# EAGLE design PulseGen (EAGLE 6.4)
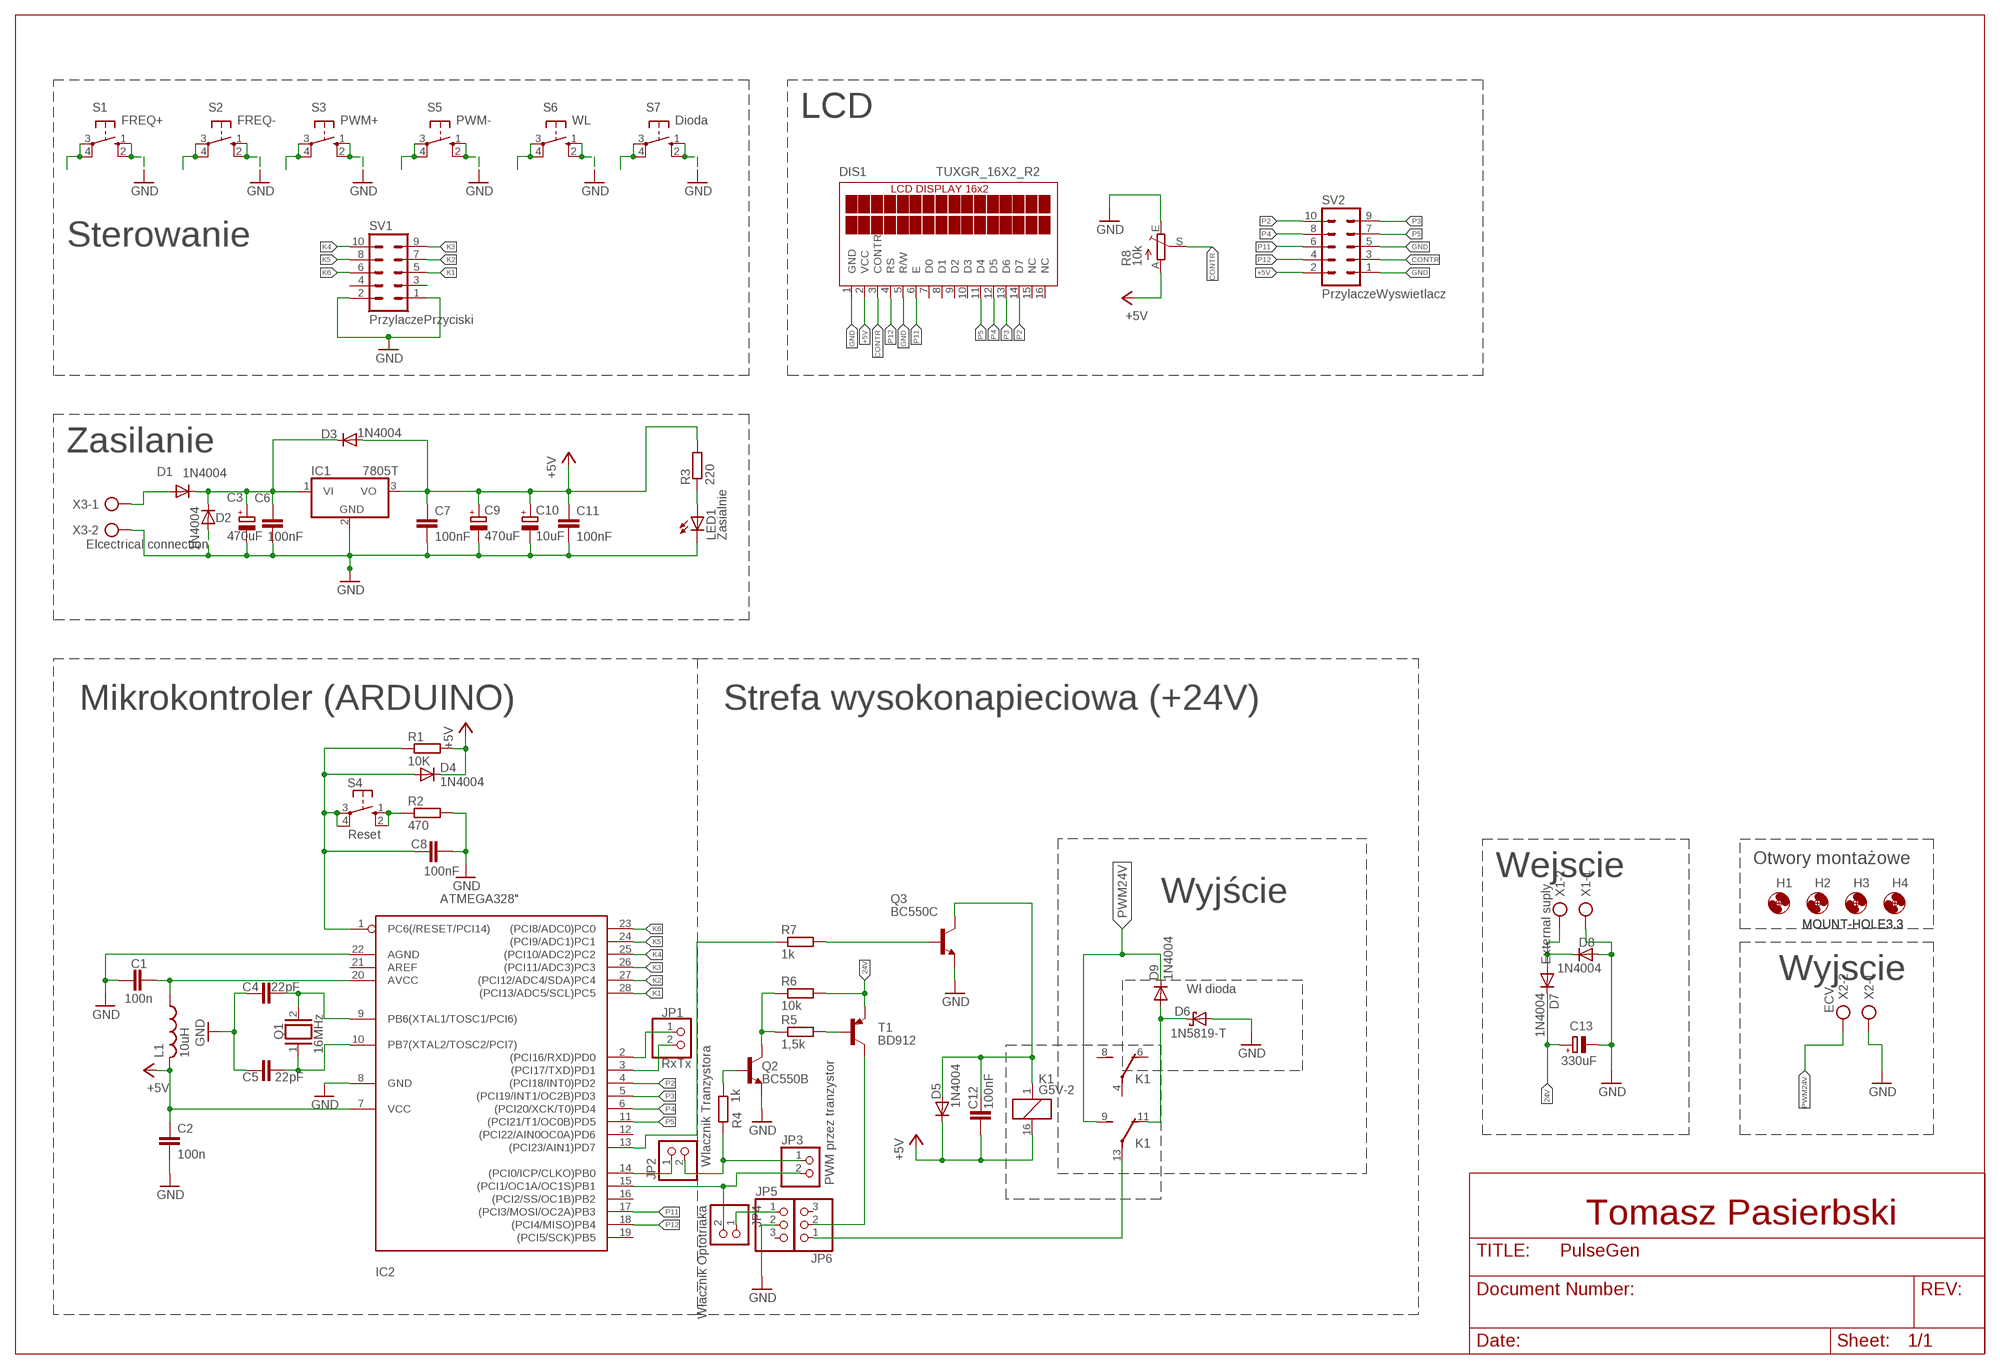
[diagram p0: schematic, sheet 1]

## Parts
C1  100n  C-EU025-030X050  [C025-030X050]
C2  100n  C-EU025-030X050  [C025-030X050]
C3  470uF  CPOL-EUE3.5-8  [E3,5-8]
C4  22pF  C-EU025-024X044  [C025-024X044]
C5  22pF  C-EU025-024X044  [C025-024X044]
C6  100nF  C-EU025-030X050  [C025-030X050]
C7  100nF  C-EU025-030X050  [C025-030X050]
C8  100nF  C-EU025-030X050  [C025-030X050]
C9  470uF  CPOL-EUE3.5-8  [E3,5-8]
C10  10uF  CPOL-EUE5-6  [E5-6]
C11  100nF  C-EU025-030X050  [C025-030X050]
C12  100nF  C-EU025-030X050  [C025-030X050]
C13  330uF  CPOL-EUE7.5-18  [E7,5-18]
D1  1N4004  [DO41-10]
D2  1N4004  [DO41-10]
D3  1N4004  [DO41-10]
D4  1N4004  [DO41-10]
D5  1N4004  [DO41-10]
D6  1N5819-T  [DO41-7.6]
D7  1N4004  [DO41-10]
D8  1N4004  [DO41-10]
D9  1N4004  [DO41-10]
DIS1  TUXGR_16X2_R2  [TUXGR_16X2_R2]
H1  MOUNT-HOLE3.3  [3,3]
H2  MOUNT-HOLE3.3  [3,3]
H3  MOUNT-HOLE3.3  [3,3]
H4  MOUNT-HOLE3.3  [3,3]
IC1  7805T  [TO220H]
IC2  ATMEGA328"  [ATMEGA328]
JP1  RxTx  PINHD-1X2  [1X02]
JP2  Wlacznik Tranzystora  PINHD-1X2  [1X02]
JP3  PWM przez tranzystor  PINHD-1X2  [1X02]
JP4  Włacznik Optotriaka  PINHD-1X2  [1X02]
JP5  PINHD-1X3  [1X03]
JP6  PINHD-1X3  [1X03]
K1  G5V-2  [G5V-2]
L1  10uH  L-US0204/7  [0204/7]
LED1  Zasialnie  LED5MM  [LED5MM]
Q1  16MHz  XTAL/S  [QS]
Q2  BC550B  [TO92-EBC]
Q3  BC550C  [TO92-EBC]
R1  10K  R-EU_0207/2V  [0207/2V]
R2  470  R-EU_0207/2V  [0207/2V]
R3  220  R-EU_0204/7  [0204/7]
R4  1k  R-EU_0204/7  [0204/7]
R5  1,5k  R-EU_0207/12  [0207/12]
R6  10k  R-EU_0204/7  [0204/7]
R7  1k  R-EU_0204/7  [0204/7]
R8  10k  TRIM_EU-CA6V  [CA6V]
S1  FREQ+  10-XX  [B3F-10XX]
S2  FREQ-  10-XX  [B3F-10XX]
S3  PWM+  10-XX  [B3F-10XX]
S4  Reset  10-XX  [B3F-10XX]
S5  PWM-  10-XX  [B3F-10XX]
S6  WL  10-XX  [B3F-10XX]
S7  Dioda  10-XX  [B3F-10XX]
SV1  PrzylaczePrzyciski  ML10  [ML10]
SV2  PrzylaczeWyswietlacz  ML10  [ML10]
T1  BD912  TIP32  [TO220]
X1  External suply  AK300/2  [AK300/2]
X2  ECV  AK300/2  [AK300/2]
X3  Elcectrical connection  AK300/2  [AK300/2]

## Nets
24V: C13.+ D7.C R6.2 T1.3(E)
+5V: C2.1 C7.1 C9.+ C10.+ C11.1 C12.2 D3.A D4.C D5.C DIS1.2(VCC) IC1.3(VO) IC2.7(VCC) K1.16 L1.2 R1.2 R3.2 R8.A SV2.2
+24V: D7.A D8.C X1.2
CONTR: DIS1.3(CONTR) R8.S SV2.3
GND: C1.2 C2.2 C3.- C4.1 C5.1 C6.2 C7.2 C8.2 C9.- C10.- C11.2 C13.- D2.A D6.A D8.A DIS1.1(GND) DIS1.5(R/W) IC1.2(GND) IC2.8(GND) IC2.22(AGND) JP5.2 LED1.K(C) Q2.E Q3.E R2.2 R8.E S1.1(S) S1.2(S1) S2.1(S) S2.2(S1) S3.1(S) S3.2(S1) S5.1(S) S5.2(S1) S6.1(S) S6.2(S1) S7.1(S) S7.2(S1) SV1.1 SV1.2 SV2.1 SV2.5 X1.1 X2.1 X3.2
K1: IC2.28((PCI13/ADC5/SCL)PC5) SV1.5
K2: IC2.27((PCI12/ADC4/SDA)PC4) SV1.7
K3: IC2.26((PCI11/ADC3)PC3) SV1.9
K4: IC2.25((PCI10/ADC2)PC2) SV1.10
K5: IC2.24((PCI9/ADC1)PC1) SV1.8
K6: IC2.23((PCI8/ADC0)PC0) SV1.6
N$1: C5.2 IC2.10(PB7(XTAL2/TOSC2/PCI7)) Q1.1
N$2: C3.+ C6.1 D1.C D2.C D3.C IC1.1(VI)
N$3: C4.2 IC2.9(PB6(XTAL1/TOSC1/PCI6)) Q1.2
N$4: D1.A X3.1
N$6: C12.1 D5.A K1.1 Q3.C
N$7: C1.1 IC2.20(AVCC) L1.1
N$8: Q3.B R7.2
N$9: JP2.2 JP3.1 R4.1
N$10: Q2.C R5.1 R6.1
N$11: R2.1 S4.1(S) S4.2(S1)
N$12: C8.1 D4.A IC2.1(PC6(/RESET/PCI14)) R1.1 S4.3(P) S4.4(P1)
N$13: JP6.1 K1.13(2:P)
N$14: IC2.13((PCI23/AIN1)PD7) R7.1
N$15: Q2.B R4.2
N$16: R5.2 T1.1(B)
N$17: JP6.2 T1.2(C)
N$18: IC2.14((PCI0/ICP/CLKO)PB0) JP2.1
N$19: LED1.A R3.1
N$20: IC2.15((PCI1/OC1A/OC1S)PB1) JP3.2 JP4.2
N$21: S1.3(P) S1.4(P1)
N$22: S2.3(P) S2.4(P1)
N$23: S3.3(P) S3.4(P1)
N$24: S5.3(P) S5.4(P1)
N$25: S6.3(P) S6.4(P1)
N$26: S7.3(P) S7.4(P1)
N$27: IC2.3((PCI17/TXD)PD1) JP1.2
N$28: IC2.2((PCI16/RXD)PD0) JP1.1
N$29: JP4.1 JP5.1
N$30: D6.C D9.A K1.11(2:O)
P2: DIS1.14(D7) IC2.4((PCI18/INT0)PD2) SV2.10
P3: DIS1.13(D6) IC2.5((PCI19/INT1/OC2B)PD3) SV2.9
P4: DIS1.12(D5) IC2.6((PCI20/XCK/T0)PD4) SV2.8
P5: DIS1.11(D4) IC2.11((PCI21/T1/OC0B)PD5) SV2.7
P11: DIS1.6(E) IC2.17((PCI3/MOSI/OC2A)PB3) SV2.6
P12: DIS1.4(RS) IC2.18((PCI4/MISO)PB4) SV2.4
PWM24V: D9.C K1.9(2:S) X2.2
Unconnected: DIS1.7(D0) DIS1.8(D1) DIS1.9(D2) DIS1.10(D3) DIS1.15(NC) DIS1.16(NC) IC2.12((PCI22/AIN0OC0A)PD6) IC2.16((PCI2/SS/OC1B)PB2) IC2.19((PCI5/SCK)PB5) IC2.21(AREF) JP5.3 JP6.3 K1.4(1:P) K1.6(1:O) K1.8(1:S) SV1.3 SV1.4

## Notes on the sheet
- LCD
- Sterowanie
- Zasilanie
- Mikrokontroler (ARDUINO) | Strefa wysokonapieciowa (+24V)
- Otwory montażowe
- Wejscie
- Wyjście
- Wyjscie
- Wł dioda
- Tomasz Pasierbski

## Library data of the parts
C1 C2 C4-C8 C11 C12 = rcl:C-EU: CAPACITOR, European symbol
C3 C9 C10 C13 = rcl:CPOL-EU: POLARIZED CAPACITOR, European symbol
D1-D5 D7-D9 = diode:1N4004: DIODE general purpose rectifier, 1 A
D6 = diode:1N581*: 1.0A SCHOTTKY BARRIER RECTIFIER Source: http://www.diodes.com/datasheets/ds23001.pdf
DIS1 = display-lcd:TUXGR_16X2_R2: Tuxgraphics LCD display 16x2 characters reflective, without background light Source: tuxgr_12x2_r2.pdf; OC_FARNELL: unknown; OC_NEWARK: unknown
H1-H4 = holes:MOUNT-HOLE: MOUNTING HOLE with drill center marker
IC1 = linear:78*: Positive VOLTAGE REGULATOR Source: http://cache.national.com/ds/LM/LM78L05.pdf http://www.fairchildsemi.com/ds/LM/LM7805.pdf
IC2 = RBBB:ATMEGA328: MICROCONTROLLER 16 kBytes FLASH 1 kBytes SRAM 512 Bytes EEPROM USART 8-channel 10 bit ADC
JP1-JP4 = pinhead:PINHD-1X2: PIN HEADER
JP5 JP6 = pinhead:PINHD-1X3: PIN HEADER
K1 = relay:G5V-2: OMRON PCB Relay Source: http://www.omron.com/ecb/products/pdf/en-g5v2.pdf; MPN: G5V-2 5DC; OC_FARNELL: 9949488; OC_NEWARK: 78K5703
L1 = rcl:L-US: INDUCTOR, American symbol
LED1 = adafruit:LED: LED OSRAM: - CHIPLED LG R971, LG N971, LY N971, LG Q971, LY Q971, LO R971, LY R971 LH N974, LH R974 LS Q976, LO Q976, LY Q976 LO Q996 - Hyper CHIPLED LW Q18S LB Q993, LB Q99A, LB R99A - SideLED LS A670, LO A670, LY A670, LG A670, LP A670 LB A673, LV A673, LT A673, LW A673 LH A674 LY A675 LS A676, LA A676, LO A676, LY A676, LW A676 LS A679, LY A679, LG A679 - Hyper Micro SIDELED® LS Y876, LA Y876, LO Y876, LY Y876 LT Y87S - SmartLED LW L88C, LW L88S LB L89C, LB L89S, LG L890 LS L89K, LO L89K, LY L89K LS L896, LA L896, LO L896, LY L896 - TOPLED LS T670, LO T670, LY T670, LG T670, LP T670 LSG T670, LSP T670, LSY T670, LOP T670, LYG T670 LG T671, LOG T671, LSG T671 LB T673, LV T673, LT T673, LW T673 LH T674 LS T676, LA T676, LO T676, LY T676, LB T676, LH T676, LSB T676, LW T676 LB T67C, LV T67C, LT T67C, LS T67K, LO T67K, LY T67K, LW E67C LS E67B, LA E67B, LO E67B, LY E67B, LB E67C, LV E67C, LT E67C LW T67C LS T679, LY T679, LG T679 LS T770, LO T770, LY T770, LG T770, LP T770 LB T773, LV T773, LT T773, LW T773 LH T774 LS E675, LA E675, LY E675, LS T675 LS T776, LA T776, LO T776, LY T776, LB T776 LHGB T686 LT T68C, LB T68C - Hyper Mini TOPLED® LB M676 - Mini TOPLED Santana® LG M470 LS M47K, LO M47K, LY M47K Source: http://www.osram.convergy.de/
Q1 = special:XTAL/S: CRYSTAL
Q2 Q3 = transistor-npn:BC550*: NPN Transistor
R1-R7 = rcl:R-EU_: RESISTOR, European symbol
R8 = pot:TRIM_EU-: POTENTIOMETER
S1-S7 = switch-omron:10-XX: OMRON SWITCH; MPN: B3F-1000; OC_FARNELL: 176432; OC_NEWARK: 36M3542
SV1 SV2 = con-harting-ml:ML10: HARTING; OC_FARNELL: unknown; OC_NEWARK: unknown
T1 = transistor:TIP32: PNP Transistor Medium Power Linear Switching Applications Source: http://onsemi.com
X1-X3 = con-ptr500:AK300/2: CONNECTOR; OC_FARNELL: unknown; OC_NEWARK: unknown

## Board
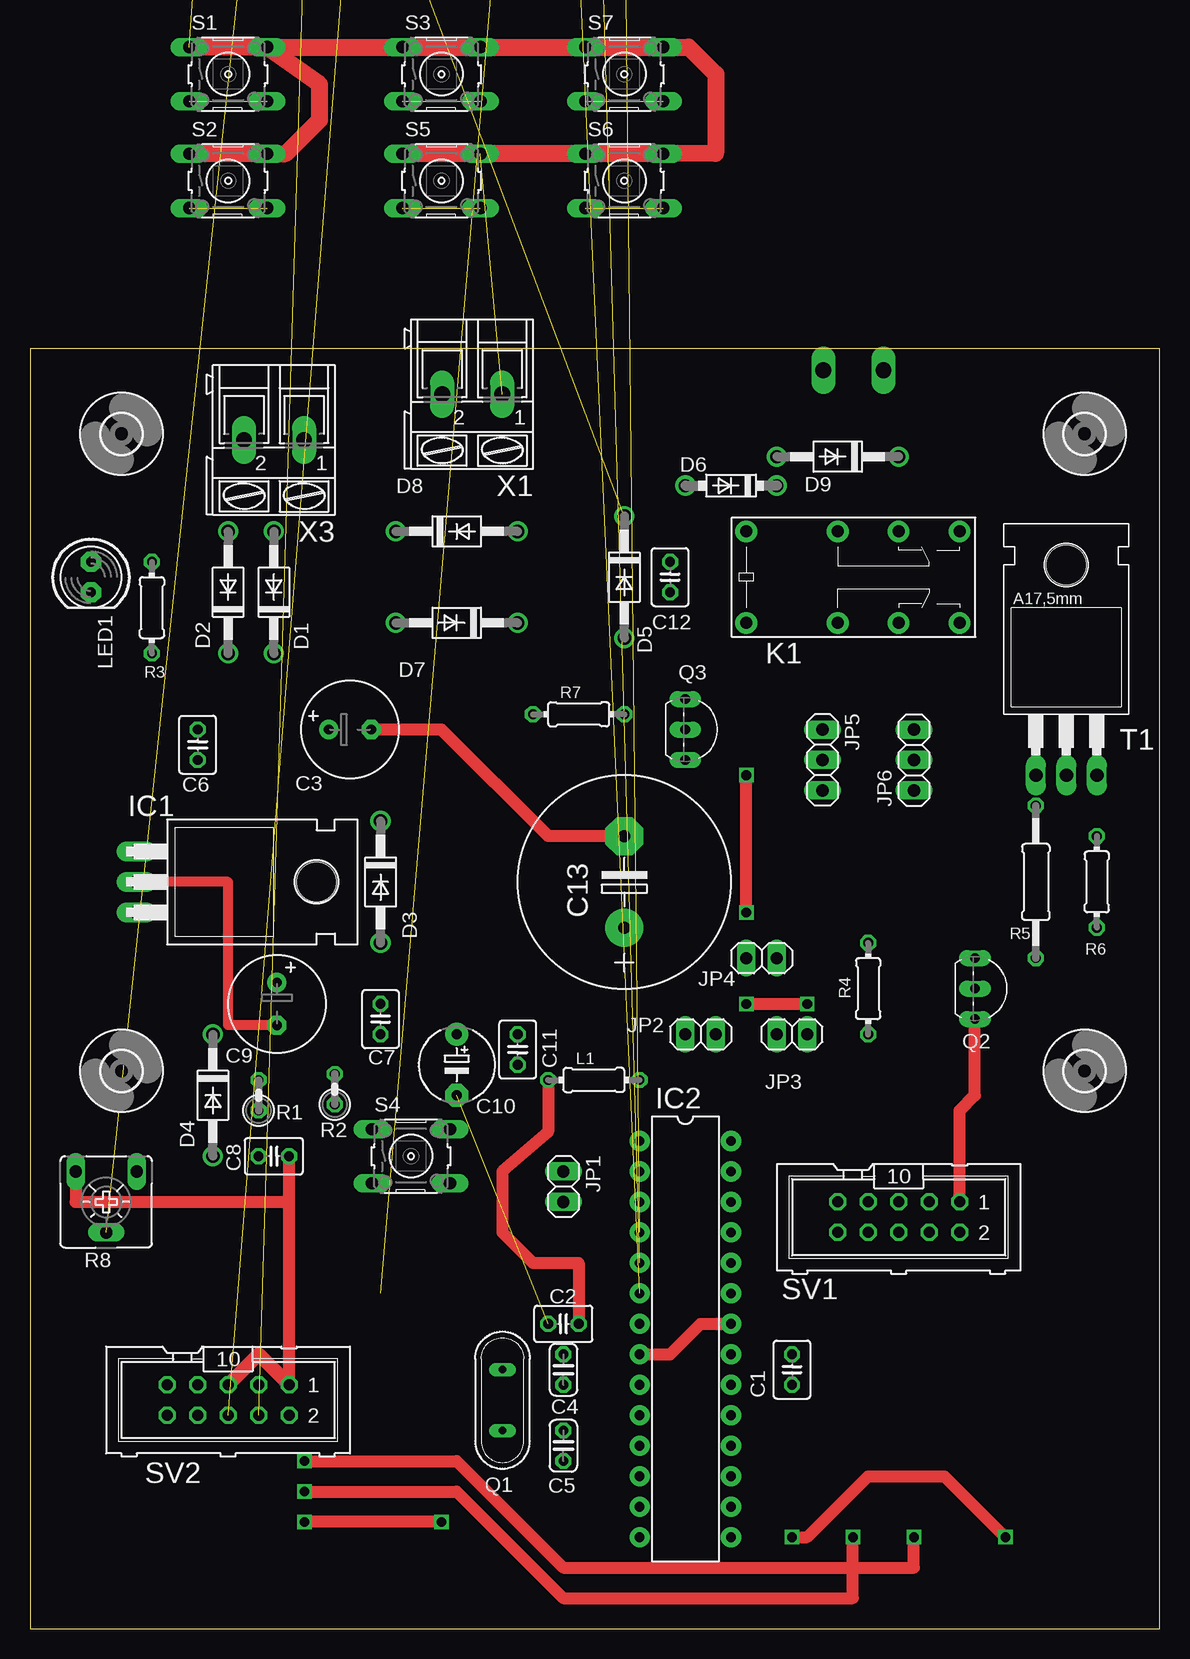
[diagram p1: board, top side]
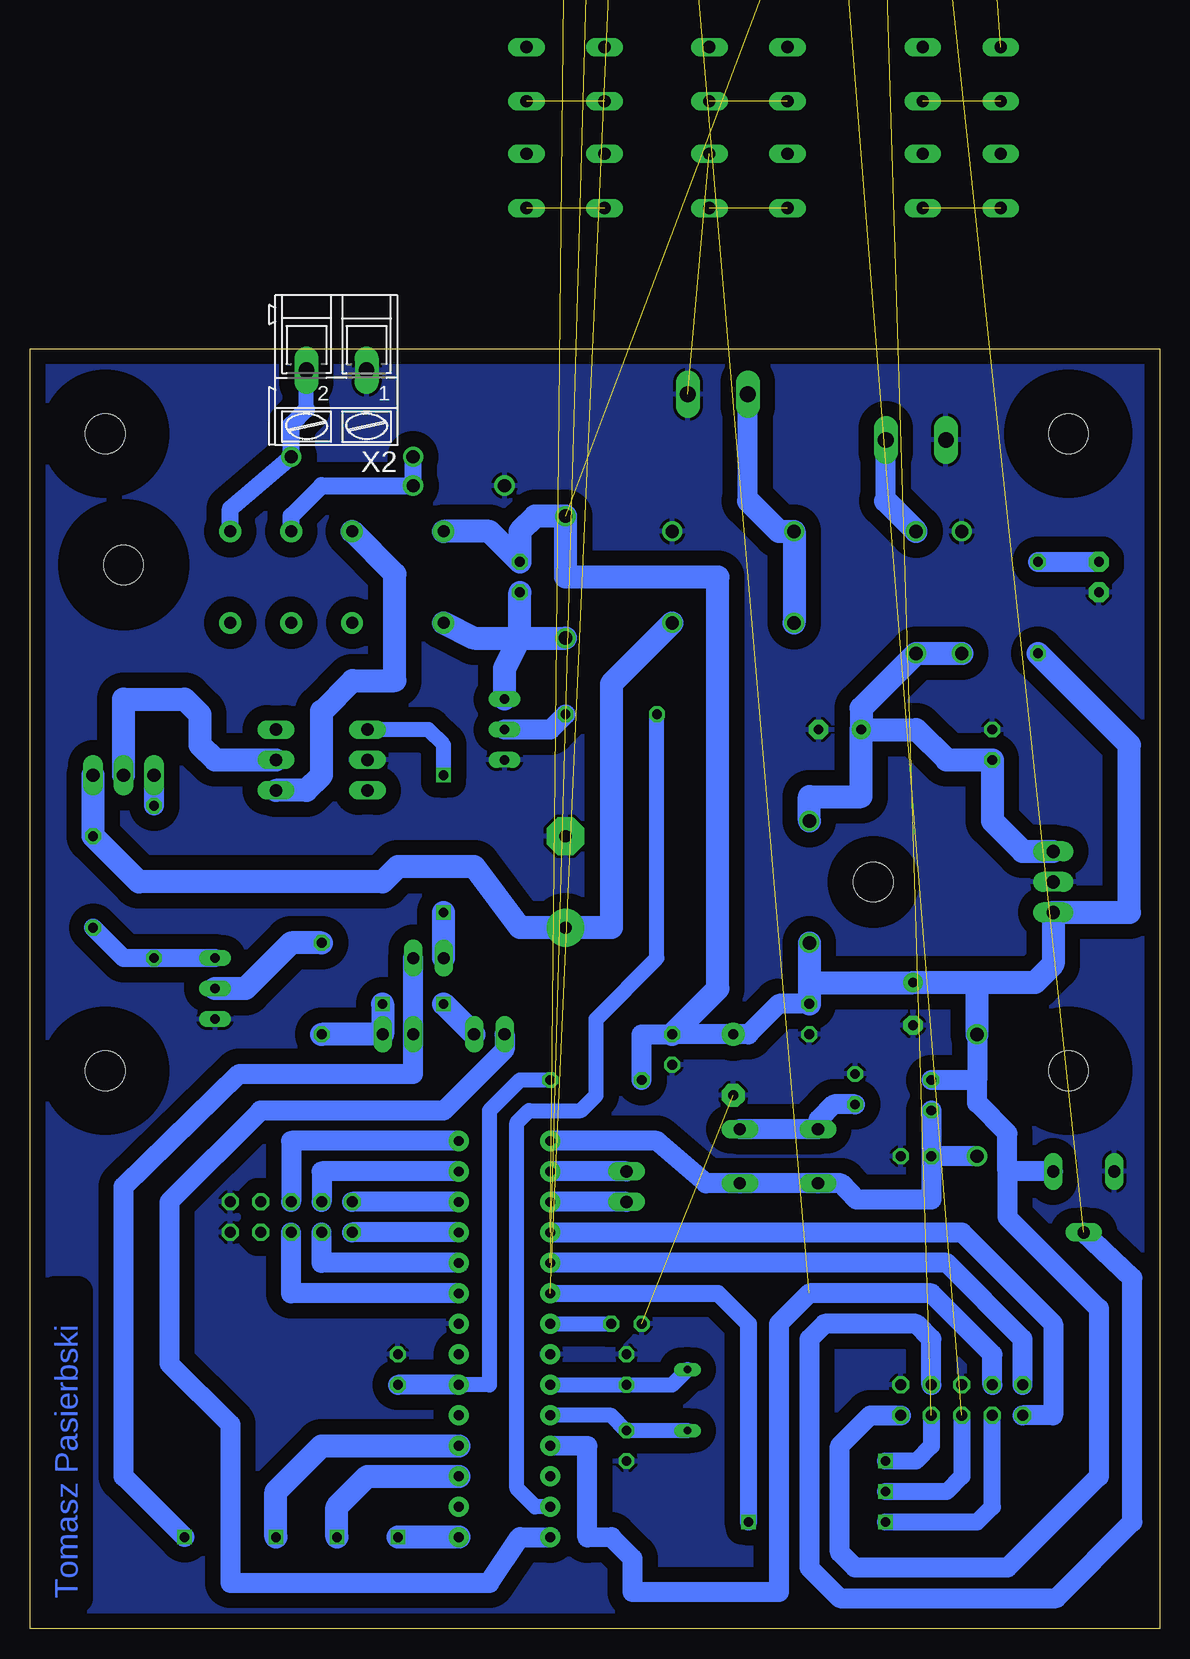
[diagram p2: board, bottom side, seen from below]

Size 94.16 x 106.67 mm. Coordinates in mm from the lower left corner, seen from the top.
Outline: 0,0 94.16,0 94.16,106.67 0,106.67 0,0
Copper layers (1*16): Top 0.035mm / dielectric 1.5mm / Bottom 0.035mm
Design rules "default": minimum track width 10mil, minimum drill 24mil, track to track 8mil, track to pad 8mil, pad to pad 8mil, via to via 8mil, smd to smd 8mil, copper to edge 40mil, drill to drill 8mil, minimum pad ring 10mil, minimum via ring 8mil, stop-mask expansion 4mil, vias tented up to drill 0mil, thermal gap 10mil

### Footprints (pad centres in the part's own frame; a part is rotated, then mirrored left to right if it is on the bottom)
C025-030X050 = drill 0.813 octagon: 1 -1.27,0; 2 1.27,0
E3,5-8 = drill 0.813 pad 1.6: + -1.778,0 | drill 0.813 pad 1.6 octagon: - 1.778,0
C025-024X044 = drill 0.813 octagon: 1 -1.27,0; 2 1.27,0
E5-6 = drill 0.813 pad 1.905: + -2.54,0 | drill 0.813 pad 1.905 octagon: - 2.54,0
E7,5-18 = drill 1.016 pad 3.15: + -3.81,0 | drill 1.016 pad 3.15 octagon: - 3.81,0
DO41-10 = drill 1.118: A 5.08,0; C -5.08,0
DO41-7.6 = drill 1.1 pad 1.7: A 3.81,0; C -3.81,0
TUXGR_16X2_R2 = drill 1 pad 1.676: 1 -32,15.5; 2 -29.46,15.5; 3 -26.92,15.5; 4 -24.38,15.5; 5 -21.84,15.5; 6 -19.3,15.5; 7 -16.76,15.5; 8 -14.22,15.5; 9 -11.68,15.5; 10 -9.14,15.5; 11 -6.6,15.5; 12 -4.06,15.5; 13 -1.52,15.5; 14 1.02,15.5; 15 3.56,15.5; 16 6.1,15.5 | hole 2.5: -37.5,-15.5; 37.5,-15.5; -37.5,15.5; 37.5,15.5
3,3 = hole 3.3: 0,0
TO220H = drill 1.118 long: 1 -2.54,-10.16; 2 0,-10.16; 3 2.54,-10.16 | hole 3.302: 0,4.826
ATMEGA328 = drill 0.813 pad 1.676: 1 -16.51,-3.81; 2 -13.97,-3.81; 3 -11.43,-3.81; 4 -8.89,-3.81; 5 -6.35,-3.81; 6 -3.81,-3.81; 7 -1.27,-3.81; 8 1.27,-3.81; 9 3.81,-3.81; 10 6.35,-3.81; 11 8.89,-3.81; 12 11.43,-3.81; 13 13.97,-3.81; 14 16.51,-3.81; 15 16.51,3.81; 16 13.97,3.81; 17 11.43,3.81; 18 8.89,3.81; 19 6.35,3.81; 20 3.81,3.81; 21 1.27,3.81; 22 -1.27,3.81; 23 -3.81,3.81; 24 -6.35,3.81; 25 -8.89,3.81; 26 -11.43,3.81; 27 -13.97,3.81; 28 -16.51,3.81
1X02 = drill 1.016 long: 1 -1.27,0; 2 1.27,0
1X03 = drill 1.016 long: 1 -2.54,0; 2 0,0; 3 2.54,0
G5V-2 = drill 1 pad 1.8: 1 -8.89,-3.81; 4 -1.27,-3.81; 6 3.81,-3.81; 8 8.89,-3.81; 9 8.89,3.81; 11 3.81,3.81; 13 -1.27,3.81; 16 -8.89,3.81
0204/7 = drill 0.813 octagon: 1 -3.81,0; 2 3.81,0
LED5MM = drill 0.813 pad 1.676 octagon: A -1.27,0; K 1.27,0
QS = drill 0.61 long: 1 -2.54,0; 2 2.54,0
TO92-EBC = drill 0.813 long: B 0,-1.27; C -2.54,-1.27; E 2.54,-1.27
0207/2V = drill 0.813 octagon: 1 -1.27,0; 2 1.27,0
0207/12 = drill 0.813 octagon: 1 -6.35,0; 2 6.35,0
CA6V = drill 1.016 long: A -2.54,-2.54; E 2.54,-2.54; S 0,2.54
B3F-10XX = drill 1.016 long: 1 -3.251,2.261; 2 3.251,2.261; 3 -3.251,-2.261; 4 3.251,-2.261
ML10 = drill 0.914 octagon: 1 -5.08,-1.27; 2 -5.08,1.27; 3 -2.54,-1.27; 4 -2.54,1.27; 5 0,-1.27; 6 0,1.27; 7 2.54,-1.27; 8 2.54,1.27; 9 5.08,-1.27; 10 5.08,1.27
TO220 = drill 1.118 long: 1 -2.54,-6.35; 2 0,-6.35; 3 2.54,-6.35 | hole 3.302: 0,11.176
AK300/2 = drill 1.321 long: 1 -2.515,0; 2 2.489,0

### Placement (x,y rotation side)
C1  63.5,21.59 90 top
C2  44.45,25.4 180 top
C3  26.67,74.93 0 top
C4  44.45,21.59 270 top
C5  44.45,15.24 90 top
C6  13.97,73.66 90 top
C7  29.21,50.8 270 top
C8  20.32,39.37 0 top
C9  20.57,52.07 270 top
C10  35.56,46.99 270 top
C11  40.64,48.26 270 top
C12  53.34,87.63 90 top
C13  49.53,62.23 90 top
D1  20.32,86.36 90 top
D2  16.51,86.36 90 top
D3  29.21,62.23 270 top
D4  15.24,44.45 270 top
D5  49.53,87.63 270 top
D6  58.42,95.25 180 top
D7  35.56,83.82 180 top
D8  35.56,91.44 0 top
D9  67.31,97.66 180 top
DIS1  48.26,158.75 0 top  (outside the outline)
DRILEGEND  [DRILEGEND]  132.33,117.09 0 top  (outside the outline)
H1  87.88,46.48 0 top
H2  7.62,46.48 0 top
H3  87.88,99.57 0 top
H4  7.62,99.57 0 top
IC1  19.05,62.23 270 top
IC2  54.61,24.13 270 top
JP1  44.45,36.83 270 top
JP2  55.88,49.53 0 top
JP3  63.5,49.53 180 top
JP4  60.96,55.88 0 top
JP5  66.04,72.39 270 top
JP6  73.66,72.39 90 top
K1  68.58,87.63 0 top
L1  46.99,45.72 180 top
LED1  5.08,87.63 270 top
Q1  39.37,19.05 90 top
Q2  80.01,53.34 270 top
Q3  55.88,74.93 270 top
R1  19.05,44.45 90 top
R2  25.4,44.96 90 top
R3  10.16,85.09 270 top
R4  69.85,53.34 90 top
R5  83.82,62.23 90 top
R6  88.9,62.23 90 top
R7  45.72,76.2 0 top
R8  6.35,35.56 180 top
S1  16.51,129.54 0 top  (outside the outline)
S2  16.51,120.65 0 top  (outside the outline)
S3  34.29,129.54 0 top  (outside the outline)
S4  31.75,39.37 0 top
S5  34.29,120.65 0 top  (outside the outline)
S6  49.53,120.65 0 top  (outside the outline)
S7  49.53,129.54 0 top  (outside the outline)
SV1  72.39,34.29 180 top
SV2  16.51,19.05 180 top
T1  86.36,77.47 0 top
U$1  [A4P-LOC]  -13.97,-71.12 0 top  (outside the outline)
X1  36.83,102.87 180 top
X2  68.63,104.88 180 bottom
X3  20.32,99.06 180 top

### Tracks (layer width: path | path; a pad name or v marks a point on that pad's centre or on a via)
24V
  Bottom 1.93: T1.3 R6.2 85.09,62.23 64.77,62.23 63.5,63.5 57.15,63.5 53.34,58.42 C13.+ 45.72,58.42 45.72,78.74 43.18,81.28 D7.C
+5V  (1 unrouted)
  Top 1.016: L1.2 43.18,41.4 39.37,38.1 39.37,33.02 41.91,30.48 45.72,30.48 C2.1
  Bottom 1.27: IC2.7 C2.1
  Bottom 1.676: C7.1 31.75,52.07 34.29,49.53 C10.+ C11.1 43.18,49.53 L1.2 | D4.C 15.24,45.72 | 15.24,45.72 R1.2 | 12.7,38.1 12.7,41.27 15.24,43.81 15.24,45.72 | R8.A 12.7,38.1 | 12.7,38.1 12.7,34.29 5.08,26.67 5.08,12.7 12.7,5.08 25.4,5.08 26.67,6.35 26.67,15.24 24.13,17.78 SV2.2
  Bottom 1.93: R3.2 2.54,73.66 2.54,59.69 IC1.3 8.89,55.37 10.41,53.85 15.24,53.85 | D3.A 29.21,53.85 | 29.21,53.85 C9.+ 15.24,53.85 | K1.16 55.88,91.44 C12.2 53.34,91.44 52.07,92.71 D5.C 49.53,87.63 36.83,87.63 36.83,53.34 C11.1 | 29.21,53.85 C7.1 | D4.C 15.24,53.85
+24V
  Bottom 1.676: 34.29,93.98 34.34,93.98 X1.2
  Bottom 1.93: 34.29,93.98 31.75,91.44 D8.C D7.A
CONTR  (1 unrouted)
  Bottom 1.676: SV2.3 19.05,24.13 20.32,25.4 27.94,25.4 29.21,24.13 29.21,5.08 26.67,2.54 8.64,2.54 2.29,8.89 2.29,29.21 R8.S
GND  (4 unrouted)
  Top 0.813: C9.- 16.51,50.29 16.51,62.23 IC1.2
  Top 1.016: SV1.1 77.47,43.18 78.74,44.45 Q2.E | R8.E 3.81,35.56 21.59,35.56 | SV2.1 21.59,35.56 | 21.59,35.56 C8.2 | IC2.8 53.34,22.86 55.88,25.4 IC2.22 | C13.- 43.18,66.04 34.29,74.93 C3.-
  Top 1.15: SV2.5 19.05,22.86 SV2.1
  Top 1.422: S1.2 24.13,128.7 24.13,125.73 21.31,122.91 S2.2 S2.1 | S1.2 S1.1 | S1.2 S3.1 S3.2 S7.1 S7.2 54.89,131.8 57.15,129.54 57.15,123.19 57.12,122.94 S6.2 S6.1 S5.2 S5.1
  pour Bottom (isolate 1.27): -5.08,111.76 101.6,111.76 101.6,-7.62 -5.08,-7.62
K1
  Bottom 1.676: IC2.28 72.39,40.64 SV1.5
K2
  Bottom 1.676: IC2.27 69.85,38.1 SV1.7
K3
  Bottom 1.676: IC2.26 SV1.9
K4
  Bottom 1.676: IC2.25 SV1.10
K5
  Bottom 1.676: IC2.24 69.85,30.48 SV1.8
K6
  Bottom 1.676: IC2.23 72.39,27.94 SV1.6
N$1
  Bottom 1.27: Q1.1 C5.2 45.72,17.78 IC2.10
N$2
  Bottom 1.93: D2.C D1.C 24.89,76.71 C3.+ | C3.+ 20.32,74.93 17.78,72.39 C6.1 13.97,67.31 11.43,64.77 IC1.1 | D3.C 29.21,69.34 24.89,69.34 C3.+
N$3
  Bottom 1.27: IC2.9 C4.2 40.64,20.32 Q1.2
N$4
  Bottom 1.676: 22.86,93.98 22.84,93.98 X3.1
  Bottom 1.93: 22.86,93.98 D1.A
N$6
  Bottom 1.93: 53.34,82.55 D5.A | K1.1 57.15,82.55 53.34,82.55 | 53.34,82.55 C12.1 | Q3.C 54.61,80.01 53.34,82.55
N$7
  Bottom 1.27: L1.1 53.34,45.72 55.88,43.18 55.88,20.32 IC2.20
  Bottom 1.676: IC2.20 C1.1
N$8
  Bottom 1.676: R7.2 50.8,74.93 Q3.B
N$9  (via drill 0.8)
  Top 1.016: v59.69,52.07 v64.77,52.07
  Bottom 1.93: R4.1 JP3.1 v64.77,52.07 | JP2.2 v59.69,52.07
N$10
  Bottom 1.501: Q2.C R5.1 86.36,55.88 R6.1
N$11
  Bottom 1.676: R2.1 27.18,43.69 28.45,42.42 28.47,41.66 S4.1 S4.2
N$12
  Bottom 1.676: IC2.1 41.91,40.64 37.82,37.11 S4.4 S4.3 26.57,37.11 25.27,35.76 19.05,35.76 C8.1 | D4.A C8.1 | R1.1 C8.1
N$13
  Bottom 1.93: K1.13 63.75,87.88 63.75,78.99 67.28,78.99 69.83,76.45 69.85,76.45 69.85,71.12 71.12,69.85 JP6.1
N$14
  Bottom 1.27: IC2.13 52.07,10.16 53.59,11.68 53.59,42.16 52.58,43.18 48.26,43.18 46.99,44.45 46.99,50.8 41.91,55.88 R7.1
N$15
  Bottom 1.93: R4.2 72.39,57.15 76.2,53.34 Q2.B
N$16
  Bottom 1.676: R5.2 T1.1
N$17
  Bottom 1.93: T1.2 86.36,77.47 81.28,77.47 80.01,76.2 80.01,73.66 78.74,72.39 JP6.2
N$18
  Bottom 1.676: JP2.1 54.61,48.26 59.69,43.18 74.93,43.18 82.55,35.56 82.55,22.1 77.47,17.02 77.47,3.81 55.88,3.81 53.34,7.62 IC2.14
N$19
  Bottom 1.676: R3.1 LED1.A
N$20  (via drill 0.8 pad 0.41)
  Top 1.016: v63.5,7.62 64.77,7.62 69.85,12.7 76.2,12.7 v81.28,7.62
  Bottom 1.676: v81.28,7.62 86.36,12.7 86.36,36.83 76.71,46.23 62.23,46.23 JP3.2 JP4.2
  Bottom 1.93: IC2.15 v63.5,7.62
N$21  (1 unrouted)
N$22  (1 unrouted)
N$23  (1 unrouted)
N$24  (1 unrouted)
N$25  (1 unrouted)
N$26  (1 unrouted)
N$27
  Bottom 1.676: JP1.2 IC2.3
N$28
  Bottom 1.676: JP1.1 IC2.2
N$29  (via drill 0.8 pad 0.41)
  Top 1.016: v59.69,59.69 v59.69,71.12
  Bottom 1.27: v59.69,71.12 59.69,73.66 60.96,74.93 JP5.1
  Bottom 1.93: JP4.1 v59.69,59.69
N$30
  Bottom 1.422: K1.11 72.39,92.71 69.85,95.25 D6.C D9.A
P2  (1 unrouted)
  Bottom 1.676: IC2.4 16.51,33.02 8.89,25.4 8.89,17.78 SV2.10
P3  (1 unrouted)
  Bottom 1.676: SV2.9 11.43,24.13 17.78,30.48 IC2.5
P4  (via drill 0.8)  (1 unrouted)
  Top 1.016: v34.29,8.89 v22.86,8.89
  Bottom 1.422: IC2.6 36.83,27.94 34.29,25.4 v34.29,8.89 | v22.86,8.89 15.24,8.89 13.97,10.16 SV2.8
P5  (1 unrouted)
  Bottom 1.676: SV2.7 13.97,22.86 19.05,27.94 29.21,27.94 31.75,25.4 31.75,3.05 43.94,3.05 43.94,5.84 45.72,7.62 47.7,7.59 47.7,15.21 IC2.11
P11  (via drill 0.8)  (1 unrouted)
  Top 1.016: v22.86,11.43 35.56,11.43 44.45,2.54 68.58,2.54 v68.58,7.62
  Bottom 1.422: SV2.6 16.51,12.7 17.78,11.43 v22.86,11.43
  Bottom 1.93: v68.58,7.62 68.58,10.16 66.04,12.7 IC2.17
P12  (via drill 0.8)  (1 unrouted)
  Top 1.016: v22.86,13.97 35.56,13.97 44.45,5.08 73.66,5.08 v73.66,7.62
  Bottom 1.422: SV2.4 19.05,15.24 20.32,13.97 v22.86,13.97
  Bottom 1.93: v73.66,7.62 73.66,11.43 69.85,15.24 IC2.18
PWM24V
  Bottom 1.27: 71.12,101.6 X2.2
  Bottom 1.422: K1.9 77.47,93.34 D9.C 72.39,100.33 71.12,101.6

### Text on the board
Bottom: Tomasz Pasierbski
Contour: Tomasz Pasierbski